# Altium schematic sheet circuit_level.SchDoc
size A; SheetNumber: 2; SheetTotal: 3
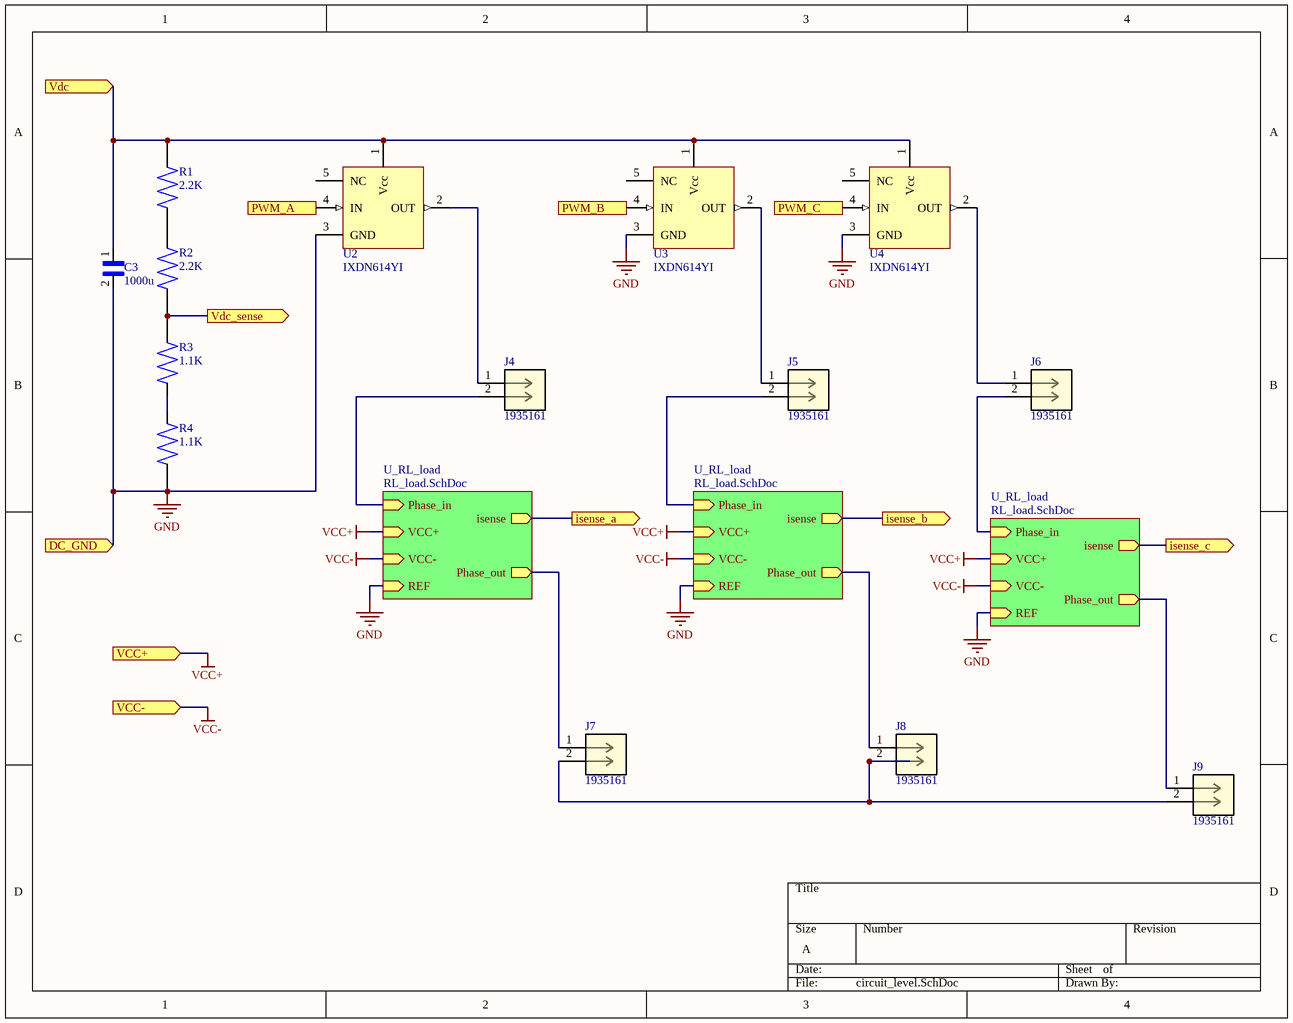
[diagram p0: circuit_level.SchDoc]

## Parts
C3  1000u
J4  1935161
J5  1935161
J6  1935161
J7  1935161
J8  1935161
J9  1935161
R1  2.2K
R2  2.2K
R3  1.1K
R4  1.1K
U2  IXDN614YI
U3  IXDN614YI
U4  IXDN614YI

## Sub-sheets
U_RL_load = RL_load.SchDoc: Phase_in (in), Phase_out (out), isense (out), VCC+ (in), VCC- (in), REF (in)
U_RL_load = RL_load.SchDoc: Phase_in (in), Phase_out (out), isense (out), VCC+ (in), VCC- (in), REF (in)
U_RL_load = RL_load.SchDoc: Phase_in (in), Phase_out (out), isense (out), VCC+ (in), VCC- (in), REF (in)

## Ports
DC_GND (in), isense_a (out), isense_b (out), isense_c (out), PWM_A (in), PWM_B (in), PWM_C (in), VCC+ (in), VCC- (in), Vdc (in), Vdc_sense (out)

## Nets
GND: C3.2 R4.2 U2.3(GND) U3.3(GND) U4.3(GND) ; port DC_GND, sheet U_RL_load/REF, sheet U_RL_load/REF, sheet U_RL_load/REF
VCC+: port VCC+, sheet U_RL_load/VCC+, sheet U_RL_load/VCC+, sheet U_RL_load/VCC+
VCC-: port VCC-, sheet U_RL_load/VCC-, sheet U_RL_load/VCC-, sheet U_RL_load/VCC-
isense_a: port isense_a, sheet U_RL_load/isense
isense_b: port isense_b, sheet U_RL_load/isense
isense_c: port isense_c, sheet U_RL_load/isense
PWM_A: U2.4(IN) ; port PWM_A
PWM_B: U3.4(IN) ; port PWM_B
PWM_C: U4.4(IN) ; port PWM_C
Vdc: C3.1 R1.1 U2.1(Vcc) U3.1(Vcc) U4.1(Vcc) ; port Vdc
Vdc_sense: R2.2 R3.1 ; port Vdc_sense
NetJ4_1: J4.1 U2.2(OUT)
NetJ4_2: J4.2 ; sheet U_RL_load/Phase_in
NetJ5_1: J5.1 U3.2(OUT)
NetJ5_2: J5.2 ; sheet U_RL_load/Phase_in
NetJ6_1: J6.1 U4.2(OUT)
NetJ6_2: J6.2 ; sheet U_RL_load/Phase_in
NetJ7_1: J7.1 ; sheet U_RL_load/Phase_out
NetJ7_2: J7.2 J8.2 J9.2
NetJ8_1: J8.1 ; sheet U_RL_load/Phase_out
NetJ9_1: J9.1 ; sheet U_RL_load/Phase_out
NetR3_2: R3.2 R4.1

Not connected (* = marked no-connect by the designer): R1 2; R2 1; U2 5(NC); U3 5(NC); U4 5(NC)

## Library data of the parts
C3 = EEU-FM1V102B: Cap Aluminum 1000uF 35V 20% (12.5 X 25mm) Radial 5mm 3190mA 7000 hr 105C Ammo Pack; Manufacturer: Panasonic; Capacitance: 1mF; Ripple Current: 3.19A; Life (Hours): 7000Hour; Impedance: 15mR; Polarity: Polar; Lead Diameter: 0.6mm; Supplier 1: Digi-Key; Manufacturer Part Number: EEU-FM1V102B; RoHS: Yes; Category: Aluminum Electrolytic Capacitors; Stock 1: 691; Pricing 1: 1=1.11000, 10=0.84300, 50=0.70060, 100=0.60330 (USD); Mount: Through Hole; Case/Package: Radial; Min Operating Temperature: -40°C; Max Operating Temperature: 105°C; Tolerance: 20%; Termination: Radial; Voltage Rating: 35V; Packaging: Tape and Reel; Package Quantity: 500; Voltage Rating (DC): 35V; ESR (Equivalent Series Resistance): 15mR; Series: FM; Construction: RADIAL; Diameter: 12mm; Length: 25mm; Height: 25mm; Lead Pitch: 5mm; Height - Seated (Max): 1.063inch; Radiation Hardening: No; Lead Free: Lead Free; RoHS Compliant: Yes; ComponentLink1URL: https://datasheet.ciiva.com/11676/aba0000ce108-11676917.pdf?src-supplier=Avnet; ComponentLink1Description: https://datasheet.ciiva.com/11676/aba0000ce108-11676917.pdf?src-supplier=Avnet; Supplier Part Number 1: P19719CT-ND
J4-J9 = 1935161: Conn Terminal Blocks 2 POS 5mm Solder ST Thru-Hole 16A; Manufacturer: Phoenix Contact; Max Supply Voltage: 250V; Current Rating: 17.5A; Number of Poles: 2; Number of Levels: 1; Current: 18A; Voltage: 300V; Voltage Rating (DC): 320V; Connector Type: Screw; Wire Gauge (Max): 26AWG; Wire Gauge (Min): 12AWG; Approvals: UL; Supplier 1: Digi-Key; Manufacturer Part Number: 1935161; RoHS: Yes; Category: Terminal Blocks; Stock 1: 82071; Pricing 1: 1=0.43000, 10=0.41400, 50=0.39600, 100=0.38520, 250=0.36000, 500=0.33120, 1000=0.30600 (USD); Mount: Through Hole; Number of Pins: 2; Color: Green; Weight: 0.067021oz; Material: Nylon; Housing Color: Green; Housing Material: Polyamide; Insulation Material: Nylon; Contact Material: Copper,Tin; Number of Rows: 1; Max Current Rating: 16A; Voltage Rating: 250V; Package Quantity: 250; Packaging: Bulk; Number of Positions: 2; Number of Positions Per Level: 2; Termination: Solder; Number of Contacts: 2; Number of Circuits: 2; Orientation: Straight; Series: COMBICON PT; Number of Ways: 2; Length: 9mm; Width: 14.9mm; Height: 11.3mm; Pitch: 5mm; Depth: 9mm; Wire/Cable Gauge: 26AWG; Radiation Hardening: No; Lead Free: Lead Free; Flammability Rating: UL94 V-0; REACH SVHC: Unknown; RoHS Compliant: Yes; ComponentLink1URL: https://datasheet.ciiva.com/15169/getdatasheetpartid-177903-15169663.pdf?src-supplier=Verical; ComponentLink1Description: https://datasheet.ciiva.com/15169/getdatasheetpartid-177903-15169663.pdf?src-supplier=Verical; ComponentLink2URL: https://datasheet.ciiva.com/16047/1935161-16047247.pdf?src-supplier=Onlinecomponents.com; ComponentLink2Description: https://datasheet.ciiva.com/16047/1935161-16047247.pdf?src-supplier=Onlinecomponents.com; ComponentLink3URL: https://datasheet.ciiva.com/824/combiconcompact5-0mmseries-824222.pdf?src-supplier=Digi-Key; ComponentLink3Description: https://datasheet.ciiva.com/824/combiconcompact5-0mmseries-824222.pdf?src-supplier=Digi-Key; Supplier Part Number 1: 277-1667-ND
R1 R2 = RCS06032K49FKEA: Res Thick Film 0603 2.49K Ohm 1% 1/4W ±100ppm/°C Molded SMD Paper T/R; Manufacturer: Vishay Dale; Resistance: 2.49kR; Max Power Dissipation: 250mW; Supplier 1: Digi-Key; Manufacturer Part Number: RCS06032K49FKEA; RoHS: Yes; Category: Chip SMD Resistors; Pricing 1: 1=0.14000, 10=0.12700, 100=0.04900, 1000=0.02154, 2500=0.01860 (USD); Case/Package: 0603; Min Operating Temperature: -55°C; Max Operating Temperature: 155°C; Package Quantity: 5000; Packaging: Tape and Reel; Resistor Type: Thick Film; Number of Terminations: 2; Features: Automotive AEC-Q200; Tolerance: 1%; Temperature Coefficient: 100ppm/°C; Length: 0.061inch; Width: 0.033inch; Height: 0.02inch; ComponentLink1URL: http://www.vishay.com/docs/20065/rcse3.pdf?src-supplier=Digi-Key; ComponentLink1Description: http://www.vishay.com/docs/20065/rcse3.pdf?src-supplier=Digi-Key; Supplier Part Number 1: 541-RCS06032K49FKEACT-ND
R3 R4 = RCS06031K10FKEA: RES SMD 1.1K OHM 1% 1/4W 0603; Manufacturer: Vishay Dale; Max Power Dissipation: 250mW; Temperature Coefficient: 100ppm/°C; Resistance: 1.1kR; Supplier 1: Digi-Key; Manufacturer Part Number: RCS06031K10FKEA; RoHS: Yes; Category: Chip SMD Resistors; Stock 1: 4990; Pricing 1: 1=0.14000, 10=0.12700, 100=0.04900, 1000=0.02154, 2500=0.01860 (USD); Case/Package: 0603; Min Operating Temperature: -55°C; Max Operating Temperature: 155°C; Tolerance: 1%; Features: Automotive AEC-Q200; Package Quantity: 5000; Packaging: Tape and Reel; Resistor Type: Thick Film; Number of Terminations: 2; Length: 0.061inch; Width: 0.033inch; Height: 0.02inch; ComponentLink1URL: http://www.vishay.com/docs/20065/rcse3.pdf?src-supplier=Digi-Key; ComponentLink1Description: http://www.vishay.com/docs/20065/rcse3.pdf?src-supplier=Digi-Key; Supplier Part Number 1: 541-RCS06031K10FKEACT-ND
U2-U4 = IXDN614YI: 14-Ampere Low-Side Ultrafast Mosfet Driver 5-Lead To-263 Rohs Compliant: Yes; Manufacturer: Ixys Clare; Rise Time: 35ns; Propagation Delay: 70ns; Max Supply Voltage: 35V; Max Output Current: 14A; Min Supply Voltage: 4.5V; Number of Outputs: 1; Fall Time: 25ns; Supplier 1: Digi-Key; Manufacturer Part Number: IXDN614YI; RoHS: Yes; Category: Gate Drivers; Pricing 1: 1=5.45000, 10=4.89400, 25=4.62640, 100=3.80390, 250=3.41328, 500=3.28990, 1000=2.73473, 2500=2.71572 (USD); Mount: Surface Mount; Case/Package: TO-263-6; Min Operating Temperature: -40°C; Max Operating Temperature: 125°C; Packaging: Rail/Tube; Package Quantity: 50; Number of Drivers: 1; Turn-On Delay Time: 70ns; Series: -; Lead Free: Lead Free; RoHS Compliant: Yes; ComponentLink1URL: https://datasheet.ciiva.com/6612/ixd-614-6612987.pdf?src-supplier=Digi-Key; ComponentLink1Description: https://datasheet.ciiva.com/6612/ixd-614-6612987.pdf?src-supplier=Digi-Key; Supplier Part Number 1: IXDN614YI-ND